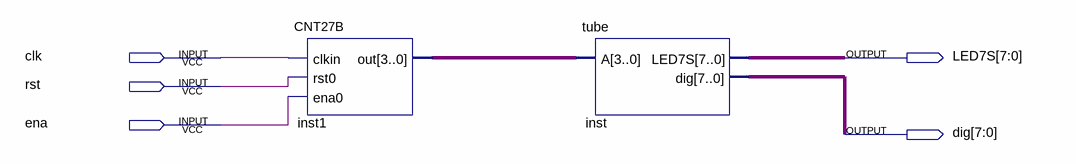
[diagram p0: schematic sheet]
// Quartus schematic Block1.bdf as structural Verilog: 2 symbols, 5 pins
module Block1 (
  input  clk,
  input  rst,
  input  ena,
  output [7:0] LED7S,
  output [7:0] dig
);

  wire [3:0] inst1_out;

  CNT27B inst1 (.clkin(clk), .rst0(rst), .ena0(ena), .out(inst1_out));
  tube inst (.A(inst1_out), .LED7S(LED7S), .dig(dig));
endmodule
